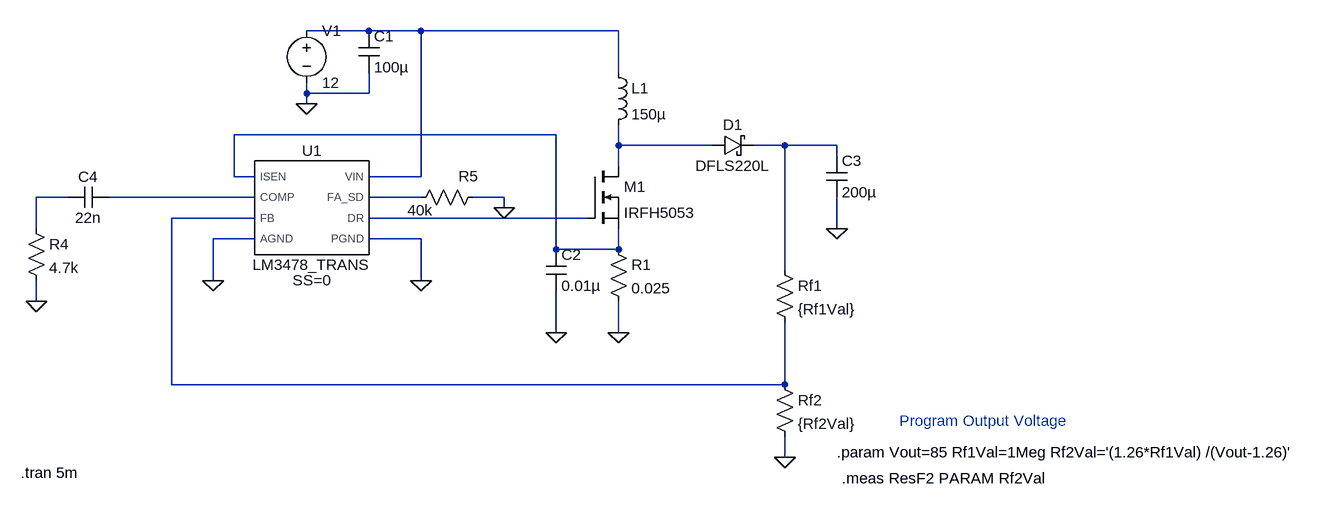
[diagram p0: schematic LM3478_Nixie_Boost.asc]
LM3478_Nixie_Boost.asc, the LTspice schematic file:
Version 4
SHEET 1 1864 10328
WIRE 320 -128 224 -128
WIRE 400 -128 320 -128
WIRE 704 -128 400 -128
WIRE 704 -64 704 -128
WIRE 224 -32 224 -48
WIRE 320 -32 320 -64
WIRE 320 -32 224 -32
WIRE 224 -16 224 -32
WIRE 608 32 112 32
WIRE 704 48 704 16
WIRE 848 48 704 48
WIRE 960 48 912 48
WIRE 1040 48 960 48
WIRE 1040 64 1040 48
WIRE 704 80 704 48
WIRE 112 96 112 32
WIRE 144 96 112 96
WIRE 400 96 400 -128
WIRE 400 96 320 96
WIRE -144 128 -192 128
WIRE 144 128 -80 128
WIRE 400 128 320 128
WIRE 528 128 480 128
WIRE 528 144 528 128
WIRE 144 160 16 160
WIRE 656 160 320 160
WIRE -192 176 -192 128
WIRE 1040 176 1040 128
WIRE 144 192 80 192
WIRE 400 192 320 192
WIRE 608 208 608 32
WIRE 704 208 704 176
WIRE 704 208 608 208
WIRE 960 240 960 48
WIRE 80 256 80 192
WIRE 400 256 400 192
WIRE -192 288 -192 256
WIRE 608 336 608 272
WIRE 704 336 704 288
WIRE 16 416 16 160
WIRE 960 416 960 320
WIRE 960 416 16 416
WIRE 960 528 960 496
FLAG 80 256 0
FLAG 400 256 0
FLAG 224 -16 0
FLAG 608 336 0
FLAG 704 336 0
FLAG 1040 176 0
FLAG 960 528 0
FLAG -192 288 0
FLAG 528 144 0
SYMBOL voltage 224 -144 R0
SYMATTR InstName V1
SYMATTR Value 12
SYMBOL cap 304 -128 R0
SYMATTR InstName C1
SYMATTR Value 100µ
SYMBOL nmos 656 80 R0
SYMATTR InstName M1
SYMATTR Value IRFH5053
SYMBOL ind 688 -80 R0
SYMATTR InstName L1
SYMATTR Value 150µ
SYMATTR SpiceLine Rser=10m
SYMBOL res 688 192 R0
SYMATTR InstName R1
SYMATTR Value 0.025
SYMBOL cap 592 208 R0
SYMATTR InstName C2
SYMATTR Value 0.01µ
SYMBOL schottky 848 64 R270
WINDOW 0 32 32 VTop 2
WINDOW 3 0 32 VBottom 2
SYMATTR InstName D1
SYMATTR Value DFLS220L
SYMATTR Description Diode
SYMATTR Type diode
SYMBOL cap 1024 64 R0
SYMATTR InstName C3
SYMATTR Value 200µ
SYMBOL res 944 224 R0
SYMATTR InstName Rf1
SYMATTR Value {Rf1Val}
SYMBOL res 944 400 R0
SYMATTR InstName Rf2
SYMATTR Value {Rf2Val}
SYMBOL cap -80 112 R90
WINDOW 0 0 32 VBottom 2
WINDOW 3 32 32 VTop 2
SYMATTR InstName C4
SYMATTR Value 22n
SYMBOL res -208 160 R0
SYMATTR InstName R4
SYMATTR Value 4.7k
SYMBOL res 496 112 R90
WINDOW 0 -1 23 VBottom 2
WINDOW 3 20 97 VTop 2
SYMATTR InstName R5
SYMATTR Value 40k
SYMBOL LM3478_TRANS 224 144 R0
SYMATTR InstName U1
TEXT -216 552 Left 2 !.tran 5m
TEXT 1040 520 Left 2 !.param Vout=85 Rf1Val=1Meg Rf2Val='(1.26*Rf1Val) /(Vout-1.26)'
TEXT 1048 560 Left 2 !.meas ResF2 PARAM Rf2Val
TEXT 1136 472 Left 2 ;Program Output Voltage

The netlist it stands for:
* LM3478_Nixie_Boost.asc
V1 N001 0 12
C1 N001 0 100µ
M1 N003 N009 N002 N002 IRFH5053
L1 N001 N003 150µ Rser=10m
R1 N002 0 0.025
C2 N002 0 0.01µ
D1 N003 N004 DFLS220L
C3 N004 0 200µ
Rf1 N004 N008 {Rf1Val}
Rf2 N008 0 {Rf2Val}
C4 N006 N005 22n
R4 N005 0 4.7k
R5 0 N007 40k
XU1 0 N006 N009 N007 N008 N002 0 N001 LM3478_TRANS SS=0  ; pins AGND COMP DR FA_SD FB ISEN PGND VIN
.model D D
.lib standard.dio
.model NMOS NMOS
.model PMOS PMOS
.lib standard.mos
.tran 5m
.param Vout=85 Rf1Val=1Meg Rf2Val='(1.26*Rf1Val) /(Vout-1.26)'
.meas ResF2 PARAM Rf2Val
* Program Output Voltage
.lib LM3478_TRANS.lib
.backanno
.end